# EasyEDA Pro project pdb.eprj, schematic can-bb5
Board Name: can-bb5; Create Date: 2026-08-11; Page Name: P1; Project Name: pdb; Schematic Name: can-bb5; Update Date: 2026-08-11; Company: EasyEDA.com; Page Size: A4; Version: V1.0
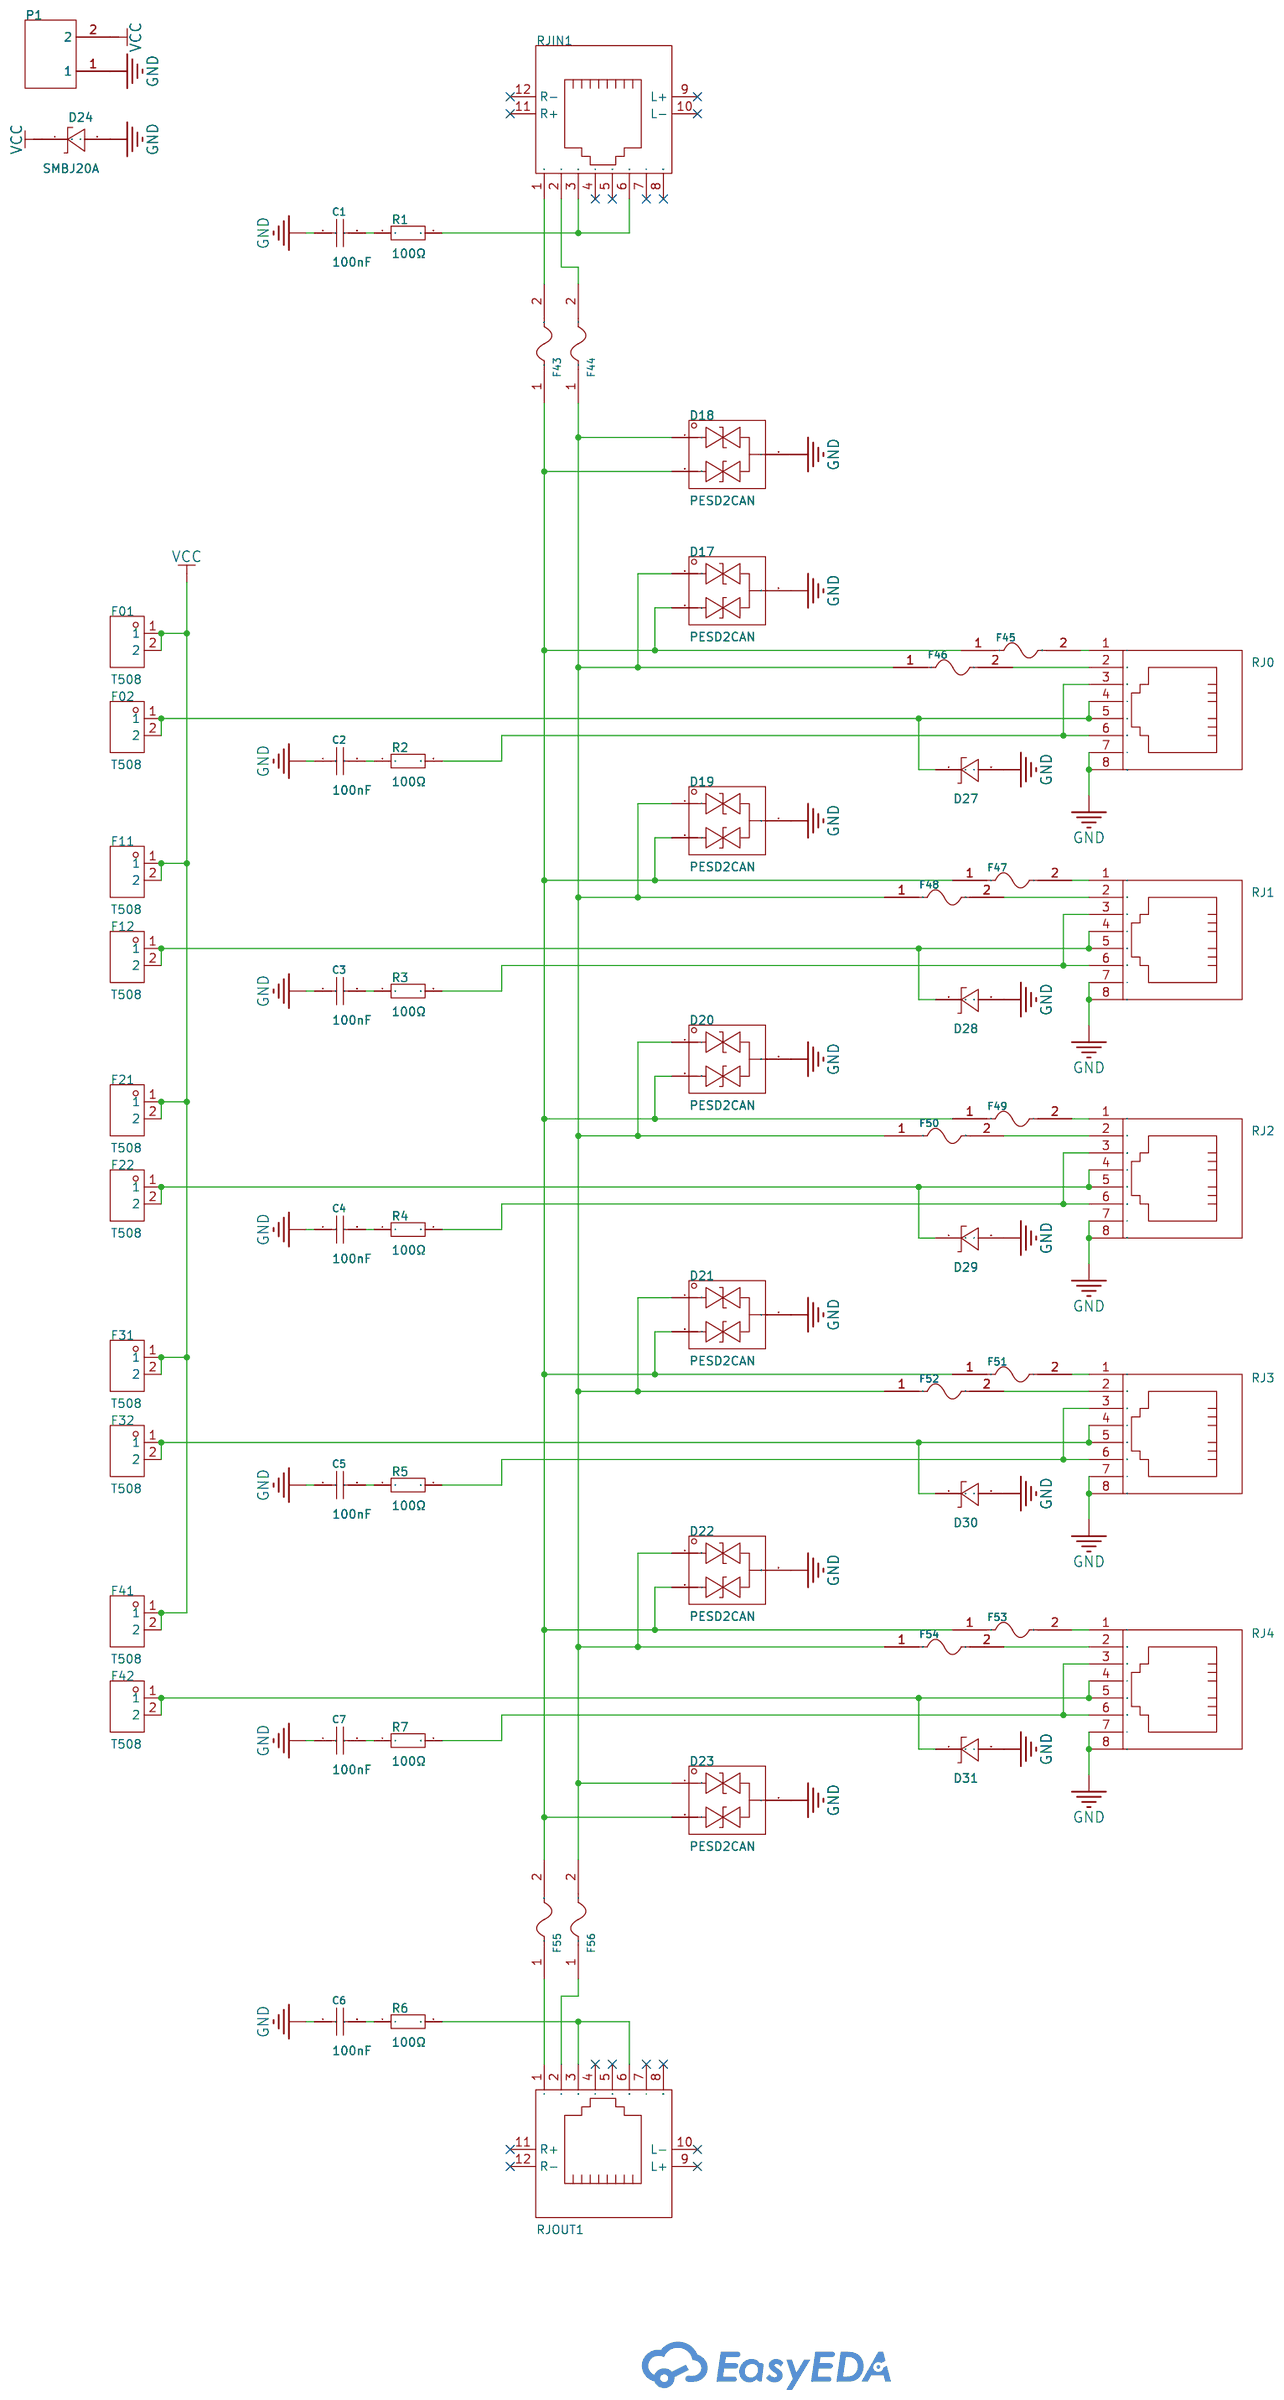
[diagram p2: schematic sheet]

## Parts
C1  100nF  [C1812]
C2  100nF  [C1812]
C3  100nF  [C1812]
C4  100nF  [C1812]
C5  100nF  [C1812]
C6  100nF  [C1812]
C7  100nF  [C1812]
D17  PESD2CAN  [SOT-23-3_L2.9-W1.3-P1.90-LS2.4-BR]
D18  PESD2CAN  [SOT-23-3_L2.9-W1.3-P1.90-LS2.4-BR]
D19  PESD2CAN  [SOT-23-3_L2.9-W1.3-P1.90-LS2.4-BR]
D20  PESD2CAN  [SOT-23-3_L2.9-W1.3-P1.90-LS2.4-BR]
D21  PESD2CAN  [SOT-23-3_L2.9-W1.3-P1.90-LS2.4-BR]
D22  PESD2CAN  [SOT-23-3_L2.9-W1.3-P1.90-LS2.4-BR]
D23  PESD2CAN  [SOT-23-3_L2.9-W1.3-P1.90-LS2.4-BR]
D24  SMBJ20A  [SMB_L4.6-W3.6-LS5.3-RD]
D27  SMBJ20A  [SMB_L4.6-W3.6-LS5.3-RD]
D28  SMBJ20A  [SMB_L4.6-W3.6-LS5.3-RD]
D29  SMBJ20A  [SMB_L4.6-W3.6-LS5.3-RD]
D30  SMBJ20A  [SMB_L4.6-W3.6-LS5.3-RD]
D31  SMBJ20A  [SMB_L4.6-W3.6-LS5.3-RD]
F01  T508  [CONN-TH_T508]
F02  T508  [CONN-TH_T508]
F11  T508  [CONN-TH_T508]
F12  T508  [CONN-TH_T508]
F21  T508  [CONN-TH_T508]
F22  T508  [CONN-TH_T508]
F31  T508  [CONN-TH_T508]
F32  T508  [CONN-TH_T508]
F41  T508  [CONN-TH_T508]
F42  T508  [CONN-TH_T508]
F43  MF-MSMF010-2  [F1812]
F44  MF-MSMF010-2  [F1812]
F45  MF-MSMF010-2  [F1812]
F46  MF-MSMF010-2  [F1812]
F47  MF-MSMF010-2  [F1812]
F48  MF-MSMF010-2  [F1812]
F49  MF-MSMF010-2  [F1812]
F50  MF-MSMF010-2  [F1812]
F51  MF-MSMF010-2  [F1812]
F52  MF-MSMF010-2  [F1812]
F53  MF-MSMF010-2  [F1812]
F54  MF-MSMF010-2  [F1812]
F55  MF-MSMF010-2  [F1812]
F56  MF-MSMF010-2  [F1812]
P1  WJ128V-5.0-02P-14-00A  [CONN-TH_2P-P5.00_WJ128V-5.0-2P]
R1  100Ω  [R1206]
R2  100Ω  [R1206]
R3  100Ω  [R1206]
R4  100Ω  [R1206]
R5  100Ω  [R1206]
R6  100Ω  [R1206]
R7  100Ω  [R1206]
RJ0  R-RJ45S08P-A004  [RJ45-TH_CKMTW_R-RJ45S08P-A004]
RJ1  R-RJ45S08P-A004  [RJ45-TH_CKMTW_R-RJ45S08P-A004]
RJ2  R-RJ45S08P-A004  [RJ45-TH_CKMTW_R-RJ45S08P-A004]
RJ3  R-RJ45S08P-A004  [RJ45-TH_CKMTW_R-RJ45S08P-A004]
RJ4  R-RJ45S08P-A004  [RJ45-TH_CKMTW_R-RJ45S08P-A004]
RJIN1  HC-RJ45-5JA-1-5  [RJ45-TH_HC-RJ45-5JA-1-5]
RJOUT1  HC-RJ45-5JA-1-5  [RJ45-TH_HC-RJ45-5JA-1-5]

## Library data of the parts
C1-C7 = FV43X104K102EGG: Capacitance:100nF Tolerance:±10% Tolerance:±10% Voltage Rating:1kV Temperature Coefficient:X7R; LCSC Part Name: 100nF ±10% 1kV; Supplier Part: C2894165; Manufacturer: PSA(信昌电陶); Supplier Footprint: 1812; JLCPCB Part Class: Extended Part; Datasheet: https://item.szlcsc.com/datasheet/FV43X104K102EGG/3128198.html; Supplier: LCSC; Tolerance: ±10%; Voltage Rating: 1kV; Temperature Coefficient: X7R
D17-D23 = PESD2CAN: Reverse Stand-Off Voltage (Vrwm):24V Clamping Voltage:54V Peak Pulse Current (Ipp):8A@8/20us Voltage - Breakdown:26.7V Type:TVS; Supplier Part: C284078; Manufacturer: DOWO(东沃); Supplier Footprint: SOT-23; JLCPCB Part Class: Extended Part; Datasheet: https://item.szlcsc.com/datasheet/PESD2CAN/269579.html; Supplier: LCSC; Reverse Stand-Off Voltage (Vrwm): 24V; Clamping Voltage: 54V; Peak Pulse Current (Ipp): 8A@8/20us; Voltage - Breakdown: 26.7V; Type: TVS
D24 D27-D31 = SMBJ20A_C364296: LCSC Part Name: 单向TVS 20V截止 峰值脉冲电流：18.6A; Supplier Part: C364296; Manufacturer: MDD(辰达半导体); Supplier Footprint: DO-214AA(SMB); Datasheet: https://item.szlcsc.com/datasheet/SMBJ20A/338608.html; Supplier: LCSC; Polarity: Unidirectional; Reverse Stand-Off Voltage (Vrwm): 20V; Clamping Voltage: 32.4V; Peak Pulse Current (Ipp): 18.6A; Peak Pulse Power Dissipation (Ppp): 600W@10/1000us; Voltage - Breakdown: 24.5V; Reverse Leakage Current (Ir): 1uA; Number of Channels: 1; Operating Temperature: -65℃~+150℃; Type: TVS
F01 F02 F11 F12 F21 F22 F31 F32 F41 F42 = T508: LCSC Part Name: 三合一插片保险丝座; Supplier Part: C41355742; Manufacturer: XFCN(兴飞); Supplier Footprint: 插件; JLCPCB Part Class: Extended Part; Datasheet: https://atta.szlcsc.com/upload/public/pdf/source/20240815/411B016330D568D94D3F7EE5B5A5790B.pdf; Supplier: LCSC; Current Rating: 30A
F43-F56 = MF-MSMF010-2: LCSC Part Name: 60V 100mA 1812自恢复; Supplier Part: C12430; Manufacturer: BOURNS; Supplier Footprint: 1812; Datasheet: https://item.szlcsc.com/datasheet/MF-MSMF010-2/13063.html; Supplier: LCSC; Voltage - Max: 60V; Current - Max: 40A; Hold Current: 100mA; Trip Current: 300mA; Power Dissipation: 800mW; Resistance - Initial (Ri) (Min): 700mΩ; Resistance - Post Trip (R1) (Max): 15Ω; Time to Trip(Max): 1.5s; Operating Temperature: -40℃~+85℃; Length: 5.4mm; Width: 3.2mm; Height: 1.1mm
P1 = WJ128V-5.0-02P-14-00A: Number of Positions or Pins:1x2P Pitch:5mm Color:Green Mounting Type:Through Hole Number of Pins:2P Number of Rows:1 Number of PINs Per Row:2 Current Rating:20A Voltage Rating (Max):250V Wire Gauge - AWG:12~22 Wire Gauge - mm2:2.5 Wire Gauge - mm2:2.5 Ope; LCSC Part Name: 5mm 1x2P 排数:1 每排P数:2 直插; Supplier Part: C8269; Manufacturer: KANGNEX(康奈克斯电气); Supplier Footprint: 插件,P=5mm; JLCPCB Part Class: Extended Part; Datasheet: https://item.szlcsc.com/datasheet/WJ128V-5.0-02P-14-00A/8761.html; Supplier: LCSC; Number of Positions or Pins: 1x2P; Pitch: 5mm; Color: Green; Mounting Type: Through Hole; Number of Pins: 2P; Number of Rows: 1; Number of PINs Per Row: 2; Current Rating: 20A; Voltage Rating (Max): 250V; Wire Gauge - AWG: 12~22; Wire Gauge - mm2: 2.5; Operating Temperature: -40℃~+105℃
R1-R7 = 1206W4F1000T5E_C17901: Type:Thick Film Resistor Resistance:100Ω Tolerance:±1% Tolerance:±1% Power(Watts):250mW Voltage-Supply(Max):200V Temperature Coefficient:±100ppm/℃ Temperature Coefficient:±100ppm/℃ Operating Temperature:-55℃~+155℃ Operating Temperature:-55℃~+155℃; LCSC Part Name: 100Ω ±1% 250mW 厚膜电阻; Supplier Part: C17901; Manufacturer: UNI-ROYAL(厚声); Manufacturer Part: 1206W4F1000T5E; Supplier Footprint: 1206; JLCPCB Part Class: Basic Part; Datasheet: https://item.szlcsc.com/datasheet/1206W4F1000T5E/18589.html; Supplier: LCSC; Type: Thick Film Resistor; Tolerance: ±1%; Power(Watts): 250mW; Voltage-Supply(Max): 200V; Temperature Coefficient: ±100ppm/℃; Operating Temperature: -55℃~+155℃
RJ0-RJ4 = R-RJ45S08P-A004: Connector Type:RJ45 Jack Mounting Type:Through Hole Number of Ports:1 LED:Non-LED Shielding:Unshielded Ratings:- Supplementary Features:Harpoon Contact (Plastic) Contact Material:Phosphor Bronze Contact Plating:Gold Operating Temperature:0℃~+70℃ Operating; LCSC Part Name: 直插 不带LED; Supplier Part: C2902702; Manufacturer: Ckmtw(灿科盟); Supplier Footprint: 插件; Datasheet: https://item.szlcsc.com/datasheet/R-RJ45S08P-A004/3156237.html; Supplier: LCSC; Connector Type: RJ45 Jack; Mounting Type: Through Hole; Number of Ports: 1; LED: Non-LED; Shielding: Unshielded; Supplementary Features: Harpoon Contact (Plastic); Contact Material: Phosphor Bronze; Contact Plating: Gold; Operating Temperature: 0℃~+70℃
RJIN1 RJOUT1 = HC-RJ45-5JA-1-5: Connector Type:RJ45 Jack Mounting Type:Right Angle Number of Ports:1 LED:With LED Shielding:Unshielded Contact Material:Phosphor Bronze Contact Plating:Gold; LCSC Part Name: 弯插 带LED; Supplier Part: C3000175; Manufacturer: HCTL(华灿天禄); Supplier Footprint: 弯插; Datasheet: https://item.szlcsc.com/datasheet/HC-RJ45-5JA-1-5/3480958.html; Supplier: LCSC; Connector Type: RJ45 Jack; Mounting Type: Right Angle; Number of Ports: 1; LED: With LED; Shielding: Unshielded; Contact Material: Phosphor Bronze; Contact Plating: Gold

## Nets
GND: C1.1 C2.1 C3.1 C4.1 C5.1 C6.1 C7.1 D17.3 D18.3 D19.3 D20.3 D21.3 D22.3 D23.3 D24.2(A) D27.2(A) D28.2(A) D29.2(A) D30.2(A) D31.2(A) P1.1 RJ0.7 RJ0.8 RJ1.7 RJ1.8 RJ2.7 RJ2.8 RJ3.7 RJ3.8 RJ4.7 RJ4.8
VCC: D24.1(K) F01.1 F01.2 F11.1 F11.2 F21.1 F21.2 F31.1 F31.2 F41.1 F41.2 P1.2
$1N12647: D27.1(K) F02.1 F02.2 RJ0.4 RJ0.5
$1N13070: D28.1(K) F12.1 F12.2 RJ1.4 RJ1.5
$1N13136: D29.1(K) F22.1 F22.2 RJ2.4 RJ2.5
$1N13202: D30.1(K) F32.1 F32.2 RJ3.4 RJ3.5
$1N14122: R1.2 RJIN1.3 RJIN1.6
$1N14137: R2.2 RJ0.3 RJ0.6
$1N14157: R3.2 RJ1.3 RJ1.6
$1N14180: R4.2 RJ2.3 RJ2.6
$1N14200: R5.2 RJ3.3 RJ3.6
$1N14223: R6.2 RJOUT1.3 RJOUT1.6
$1N14688: C6.2 R6.1
$1N14698: C5.2 R5.1
$1N14709: C4.2 R4.1
$1N14720: C3.2 R3.1
$1N14731: C2.2 R2.1
$1N14742: C1.2 R1.1
$1N16789: D31.1(K) F42.1 F42.2 RJ4.4 RJ4.5
$1N16794: R7.2 RJ4.3 RJ4.6
$1N16795: C7.2 R7.1
$1N19163: F45.2 RJ0.1
$1N19241: F46.2 RJ0.2
$1N19280: F43.2 RJIN1.1
$1N19317: F44.2 RJIN1.2
$1N19397: F47.2 RJ1.1
$1N19475: F48.2 RJ1.2
$1N19555: F49.2 RJ2.1
$1N19633: F50.2 RJ2.2
$1N19713: F51.2 RJ3.1
$1N19791: F52.2 RJ3.2
$1N19871: F53.2 RJ4.1
$1N19949: F54.2 RJ4.2
$1N20029: F55.1 RJOUT1.1
$1N20061: D17.2 D18.2 D19.2 D20.2 D21.2 D22.2 D23.2 F43.1 F45.1 F47.1 F49.1 F51.1 F53.1 F55.2
$1N20121: F56.1 RJOUT1.2
$1N20153: D17.1 D18.1 D19.1 D20.1 D21.1 D22.1 D23.1 F44.1 F46.1 F48.1 F50.1 F52.1 F54.1 F56.2

Not connected (* = marked no-connect by the designer): RJIN1 4* 5* 7* 8* 9(L+)* 10(L-)* 11(R+)* 12(R-)*; RJOUT1 4* 5* 7* 8* 9(L+)* 10(L-)* 11(R+)* 12(R-)*
